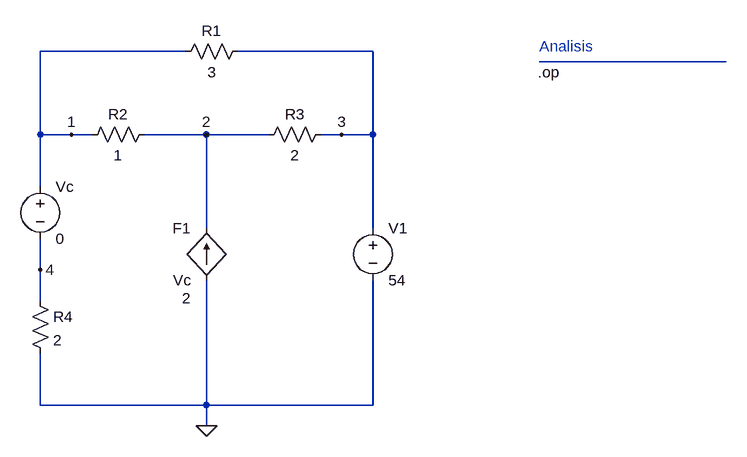
[diagram p0: schematic ejemplo3_corrientes_mallas.asc]
ejemplo3_corrientes_mallas.asc, the LTspice schematic file:
Version 4
SHEET 1 880 680
WIRE -160 32 -384 32
WIRE 128 32 -80 32
WIRE 672 48 384 48
WIRE -384 160 -384 32
WIRE -336 160 -384 160
WIRE -304 160 -336 160
WIRE -128 160 -224 160
WIRE -32 160 -128 160
WIRE 80 160 48 160
WIRE 128 160 128 32
WIRE 128 160 80 160
WIRE -384 240 -384 160
WIRE -128 304 -128 160
WIRE 128 304 128 160
WIRE -384 368 -384 320
WIRE -384 416 -384 368
WIRE -384 576 -384 496
WIRE -128 576 -128 384
WIRE -128 576 -384 576
WIRE 128 576 128 384
WIRE 128 576 -128 576
WIRE -128 608 -128 576
FLAG -128 608 0
FLAG -336 160 1
FLAG -128 160 2
FLAG 80 160 3
FLAG -384 368 4
SYMBOL res -64 16 R90
WINDOW 0 0 56 VBottom 2
WINDOW 3 32 56 VTop 2
SYMATTR InstName R1
SYMATTR Value 3
SYMBOL res -208 144 R90
WINDOW 0 0 56 VBottom 2
WINDOW 3 32 56 VTop 2
SYMATTR InstName R2
SYMATTR Value 1
SYMBOL res -48 176 R270
WINDOW 0 32 56 VTop 2
WINDOW 3 0 56 VBottom 2
SYMATTR InstName R3
SYMATTR Value 2
SYMBOL voltage 128 288 R0
SYMATTR InstName V1
SYMATTR Value 54
SYMBOL voltage -384 224 R0
SYMATTR InstName Vc
SYMATTR Value 0
SYMBOL f -128 384 R180
WINDOW 0 24 80 Left 2
WINDOW 3 24 0 Left 2
WINDOW 123 24 -28 Left 2
SYMATTR InstName F1
SYMATTR Value Vc
SYMATTR Value2 2
SYMBOL res -400 400 R0
SYMATTR InstName R4
SYMATTR Value 2
TEXT 382 64 Left 2 !.op
TEXT 384 24 Left 2 ;Analisis

The netlist it stands for:
* ejemplo3_corrientes_mallas.asc
R1 3 1 3
R2 2 1 1
R3 2 3 2
V1 3 0 54
Vc 1 4 0
F1 0 2 Vc 2
R4 4 0 2
.op
* Analisis
.backanno
.end